# EAGLE schematic weatherpod (EAGLE 7.6.0)
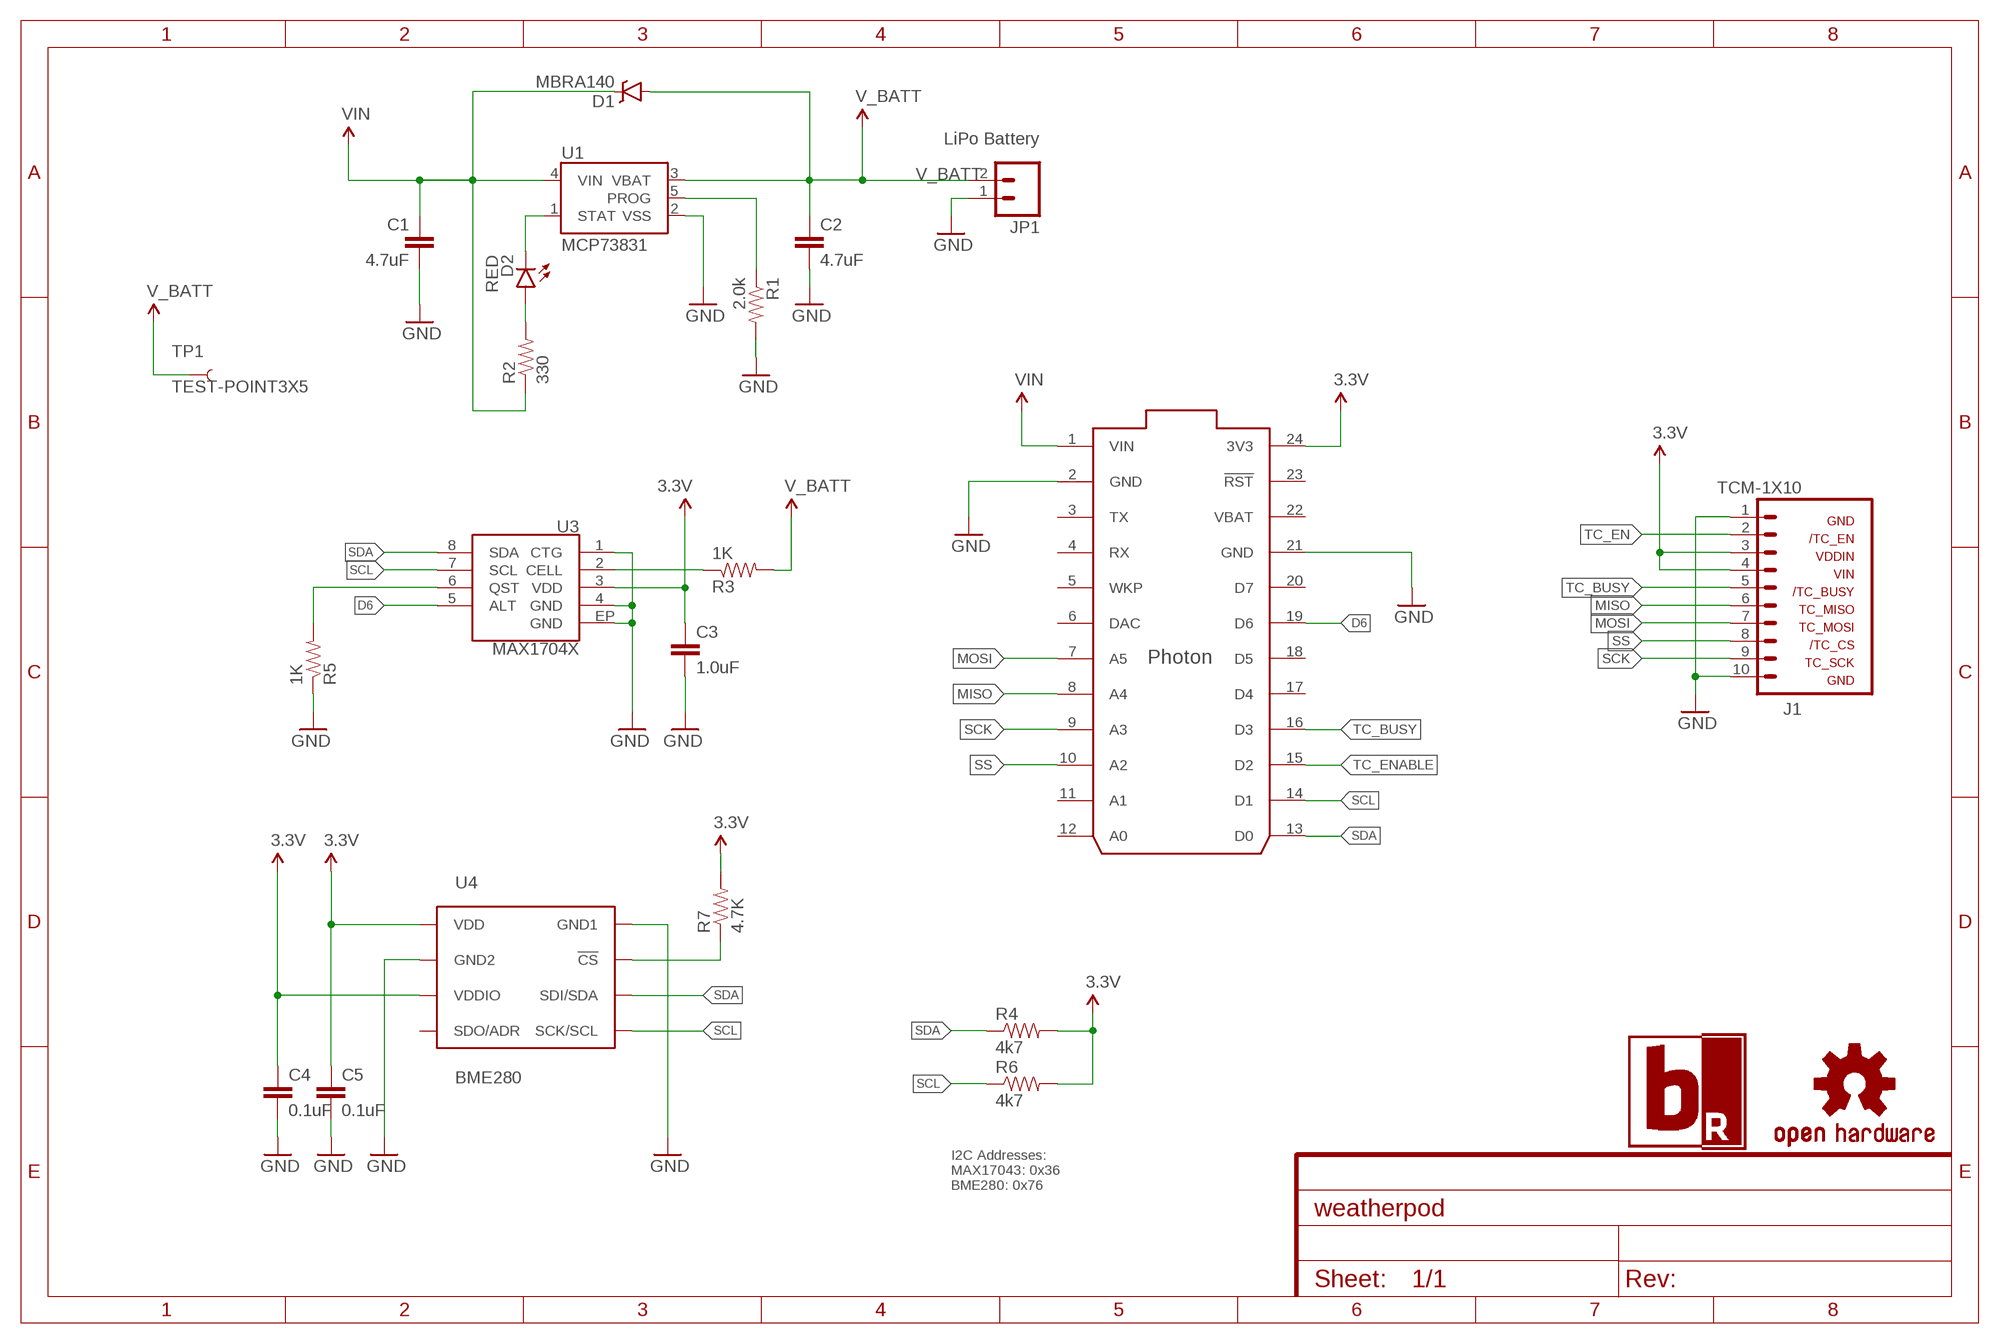
[diagram p0: schematic, sheet 1]
FRAME1 (FRAME-A4L): CNAME: bRAiNRAPERS; CREVISION: A; DESIGNER: OXullo Intersecans

## Parts
C1  4.7uF  4.7UF-6.3V-10%(0603)0603  [0603-CAP]
C2  4.7uF  4.7UF-6.3V-10%(0603)0603  [0603-CAP]
C3  1.0uF  1.0UF-16V-10%(0603)  [0603-CAP]
C4  0.1uF  0.1UF-25V-5%(0603)  [0603-CAP]
C5  0.1uF  0.1UF-25V-5%(0603)  [0603-CAP]
D1  MBRA140  DIODE-SCHOTTKY-MBRA140  [SMA-DIODE]
D2  RED  LED-RED0603  [LED-0603]
J1  TCM-1X10  [1X10]
JP1  M02-JST-2MM-SMT  [JST-2-SMD]
LOGO1  OSHW-LOGOS-COPPER  [OSHW-LOGO-S_COPPER]
LOGO2  BR-LOGO  [BR-LOGO-SMALL-COPPER]
R1  2.0k  2.0KOHM1/10W5%(0603)  [0603-RES]
R2  330  330OHM1/10W1%(0603)  [0603-RES]
R3  1K  1KOHM-1/10W-1%(0603)  [0603-RES]
R4  4k7  10KOHM-1/10W-1%(0603)0603  [0603-RES]
R5  1K  1KOHM-1/10W-1%(0603)  [0603-RES]
R6  4k7  10KOHM-1/10W-1%(0603)0603  [0603-RES]
R7  4.7K  4.7KOHM-1/10W-1%(0603)  [0603-RES]
TP1  TEST-POINT3X5  [PAD.03X.05]
U1  MCP73831  [SOT23-5]
U2  PHOTON_SMD  [PHOTON_SMD]
U3  MAX1704X  [TDFN-8]
U4  BME280  [BME280_LGA]

## Nets
3.3V: C3.1 C4.1 C5.1 J1.3 J1.4 R4.2 R6.2 R7.2 U2.24(3V3) U3.3(VDD) U4.P$6(VDDIO) U4.P$8(VDD)
!CS: R7.1 U4.P$2(!CS)
D6: U2.19(D6) U3.5(ALT)
GND: C1.2 C2.2 C3.2 C4.2 C5.2 J1.1 J1.10 JP1.1 R1.2 R5.1 U1.2(VSS) U2.2(GND) U2.21(GND) U3.1(CTG) U3.4(GND) U3.EP(GND) U4.P$1(GND1) U4.P$7(GND2)
MISO: J1.6 U2.8(A4)
MOSI: J1.7 U2.7(A5)
N$1: D2.A R2.2
N$2: D2.C U1.1(STAT)
N$3: R1.1 U1.5(PROG)
N$5: R3.1 U3.2(CELL)
N$6: R5.2 U3.6(QST)
SCK: J1.9 U2.9(A3)
SCL: R6.1 U2.14(D1) U3.7(SCL) U4.P$4(SCK/SCL)
SDA: R4.1 U2.13(D0) U3.8(SDA) U4.P$3(SDI/SDA)
SS: J1.8 U2.10(A2)
TC_BUSY: J1.5 U2.16(D3)
TC_EN: J1.2
TC_ENABLE: U2.15(D2)
V_BATT: C2.1 D1.A JP1.2 R3.2 TP1.P$1 U1.3(VBAT)
VIN: C1.1 D1.C R2.1 U1.4(VIN) U2.1(VIN)
Unconnected: U2.3(TX) U2.4(RX) U2.5(WKP) U2.6(DAC) U2.11(A1) U2.12(A0) U2.17(D4) U2.18(D5) U2.20(D7) U2.23(!RST) U2.25(EN) U2.26(!SETUP) U2.27(RGB_RED) U2.28(RGB_GREEN) U2.29(RGB_BLUE) U2.30(USB_D-) U2.31(USB_D+) U4.P$5(SDO/ADR)

## Notes on the sheet
- LiPo Battery
- I2C Addresses:
  MAX17043: 0x36
  BME280: 0x76

## Power pins joined to a net without a drawn wire
VBAT: U2.22(VBAT)

## Library data of the parts
C1 C2 = SparkFun-Capacitors:4.7UF-6.3V-10%(0603): CAP-08280; PROD_ID: CAP-08280
C3 = SparkFun-Capacitors:1.0UF-16V-10%(0603): CAP-00868; PROD_ID: CAP-00868
C4 C5 = SparkFun-Capacitors:0.1UF-25V-5%(0603): CAP-08604; PROD_ID: CAP-08604
D1 = SparkFun-DiscreteSemi:DIODE-SCHOTTKY: Schottky diodes in SFE's production catalog BAT20J 1A 23V 0.62Vf RB751 120mA 40V 0.37Vf PMEG4005EJ 0.5A 40V 0.42Vf MBRA140 1A 40V 0.5Vf B340A 3A 40V SMA; PROD_ID: DIO-08053
D2 = SparkFun-LED:LED-RED: Assorted Red LEDs LilyPad 1206- DIO-09912 1206- DIO-00809 0603- DIO-00819; PROD_ID: DIO-00819
J1 = br:TCM-1X10
JP1 = SparkFun-Connectors:M02: Standard 2-pin 0.1" header. Use with - straight break away headers ( PRT-00116) - right angle break away headers (PRT-00553) - swiss pins (PRT-00743) - machine pins (PRT-00117) - female headers (PRT-00115) Molex polarized connector foot print use with: PRT-08233 with associated crimp pins and housings. 2.54_SCREWTERM for use with PRT-10571. 3.5mm Screw Terminal footprints for PRT-08084 5mm Screw Terminal footprints for use with PRT-08432; PROD_ID: CONN-11443
LOGO1 = SparkFun-Aesthetics:OSHW-LOGO: Open Source Hardware Logo This logo indicates the piece of hardware it is found on incorporates a OSHW license and/or adheres to the definition of open source hardware found here: http://freedomdefined.org/OSHW
LOGO2 = br:BR-LOGO: BR Logo
R1 = SparkFun-Resistors:2.0KOHM1/10W5%(0603): RES-08296; PROD_ID: RES-08296
R2 = SparkFun-Resistors:330OHM1/10W1%(0603): RES-00818; PROD_ID: RES-00818
R3 R5 = SparkFun-Resistors:1KOHM-1/10W-1%(0603): RES-07856; PROD_ID: RES-07856
R4 R6 = SparkFun-Resistors:10KOHM-1/10W-1%(0603): RES-00824; PROD_ID: RES-00824; VALUE: 10K
R7 = SparkFun-Resistors:4.7KOHM-1/10W-1%(0603): RES-07857; PROD_ID: RES-07857
TP1 = SparkFun-Passives:TEST-POINT: Bare copper test points for troubleshooting or ICT
U1 = SparkFun-PowerIC:MCP73831: Miniature single cell, fully integrated Li-Ion, Li-polymer charge management controller http://ww1.microchip.com/downloads/en/DeviceDoc/21984a.pdf IC-09995; PROD_ID: IC-09995
U2 = Particle-Devices:PHOTON_SMD: Particle Photon (without headers) WiFi development board footprint - designed to be surface mounted with 7 extra exposed pads on the bottom of the board which include, 3 RGB LED outputs, /SETUP, EN (3.3V SMPS enable input), USB D+ and USB D-.
U3 = SparkFun-PowerIC:MAX1704X: MAX17043/MAX17044: Battery Fuel Guage (43 is 1cell, 44 is 2cell); PROD_ID: IC-10399
U4 = BME280ComponentLibrary:BME280; PROD_ID: IC-13090